# EasyEDA Pro project Servo module.epro

# Schematic Schematic1
Board Name: Board1; Create Date: 2026-03-25; Page Name: P1; Project Name: servo board rs485; Schematic Name: Schematic1; Update Date: 2026-04-03; Company: EasyEDA.com; Page Size: A4; Version: V1.0
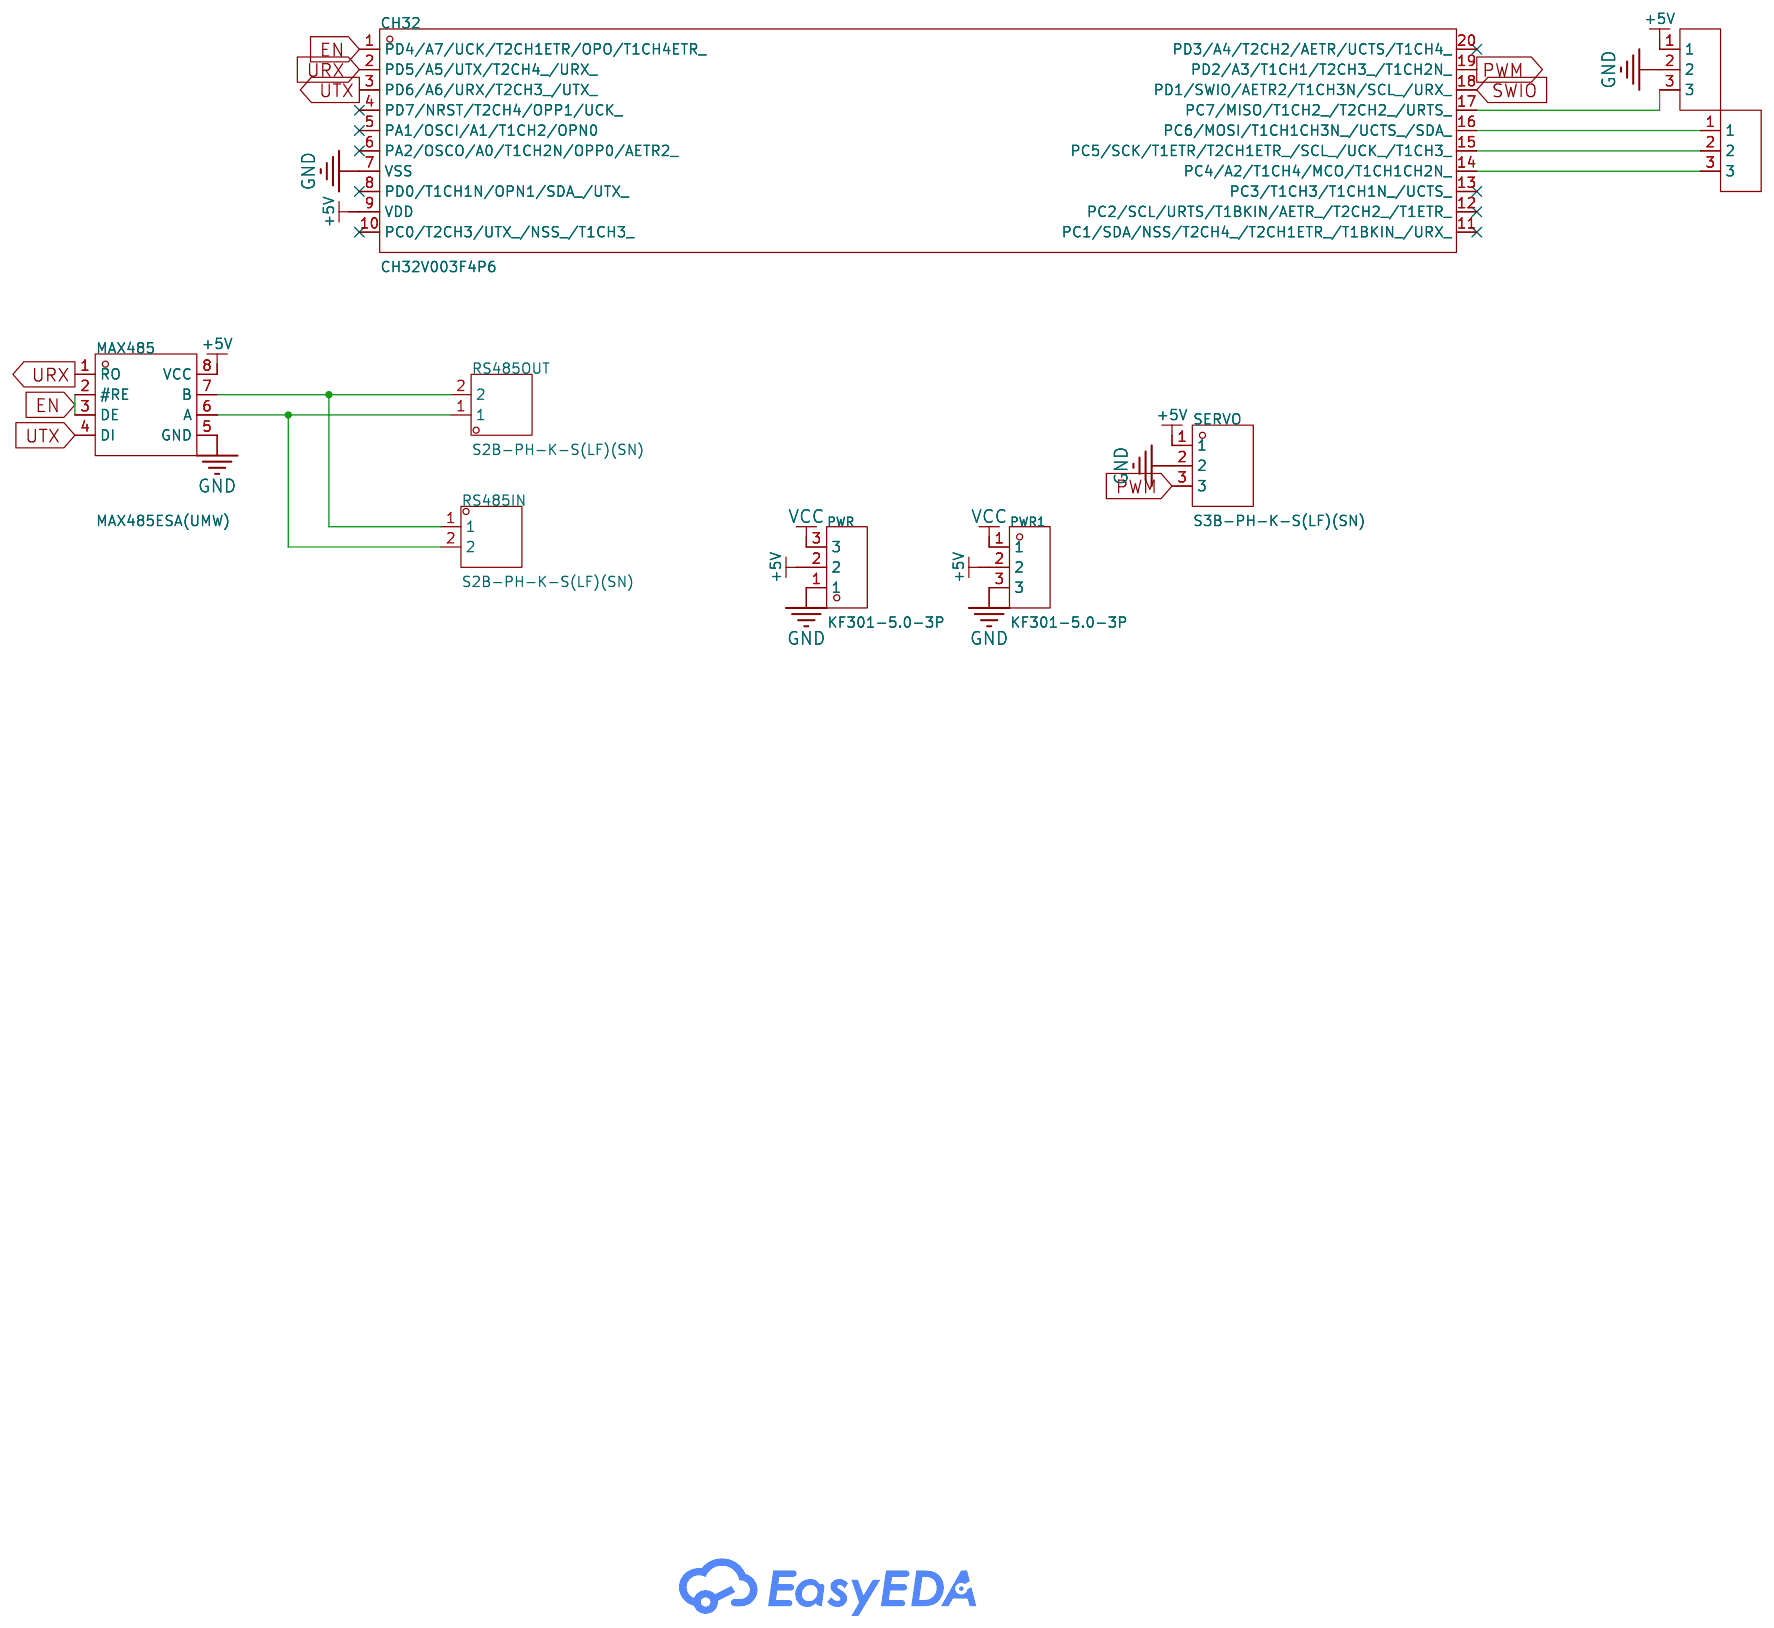
[diagram p0: schematic sheet]

## Parts
CH32  CH32V003F4P6  [TSSOP-20_L6.5-W4.4-P0.65-LS6.4-BL]
H5  -  [HDR-TH_3P-P2.54-V-M]
H6  -  [HDR-TH_3P-P2.54-V-M]
MAX485  MAX485ESA(UMW)  [SOP-8_L5.0-W4.0-P1.27-LS6.0-BL]
PWR  KF301-5.0-3P  [CONN-TH_3P-P5.00_KF301-5.0-3P]
PWR1  KF301-5.0-3P  [CONN-TH_3P-P5.00_KF301-5.0-3P]
RS485IN  S2B-PH-K-S(LF)(SN)  [CONN-TH_S2B-PH-K-S-LF-SN]
RS485OUT  S2B-PH-K-S(LF)(SN)  [CONN-TH_S2B-PH-K-S-LF-SN]
SERVO  S3B-PH-K-S(LF)(SN)  [CONN-TH_3P-P2.00_S3B-PH-K-S-LF-SN]

## Library data of the parts
CH32 = CH32V003F4P6: LCSC Part Name: QingKe V2微处理器; Supplier Part: C5187096; Manufacturer: WCH(南京沁恒); Supplier Footprint: TSSOP-20-175mil; JLCPCB Part Class: Extended Part; Datasheet: https://item.szlcsc.com/datasheet/CH32V003F4P6/5858783.html; Supplier: LCSC
H5 H6 = HDR-M_2.54_1x3P: Supplier Footprint: Through
MAX485 = MAX485ESA(UMW): Type:Transceiver Number of Drivers:1 Number of Receivers:1 Voltage - Supply:5V Voltage - Supply:5V Data Rate:2.5Mbps Data Rate:2.5Mbps Number of Nodes:32 Supply Current (Iq):300uA Communication Mode:Half-Duplex; LCSC Part Name: 低功耗、压摆率受限的RS-485/RS-422收发器; Supplier Part: C668206; Manufacturer: UMW(友台半导体); Supplier Footprint: SOP-8; JLCPCB Part Class: Extended Part; Datasheet: https://item.szlcsc.com/datasheet/MAX485ESA(UMW)/698054.html; Supplier: LCSC; Type: Transceiver; Number of Drivers: 1; Number of Receivers: 1; Voltage - Supply: 5V; Data Rate: 2.5Mbps; Number of Nodes: 32; Supply Current (Iq): 300uA; Communication Mode: Half-Duplex
PWR PWR1 = KF301-5.0-3P: Number of Positions or Pins:1x3P Pitch:5mm Color:Blue Mounting Type:Through Hole Number of Pins:3P Number of Rows:1 Number of PINs Per Row:3 Current Rating:17A Voltage Rating (Max):250V Wire Gauge - AWG:14~22 Wire Gauge - mm2:1.5 Wire Gauge - mm2:1.5 Oper; LCSC Part Name: 1x3P 5mm 直插 排数:1 每排P数:3; Supplier Part: C474882; Manufacturer: KEFA(科发); Supplier Footprint: 插件,P=5mm; JLCPCB Part Class: Extended Part; Datasheet: https://item.szlcsc.com/datasheet/KF301-5.0-3P/481500.html; Supplier: LCSC; Number of Positions or Pins: 1x3P; Pitch: 5mm; Color: Blue; Mounting Type: Through Hole; Number of Pins: 3P; Number of Rows: 1; Number of PINs Per Row: 3; Current Rating: 17A; Voltage Rating (Max): 250V; Wire Gauge - AWG: 14~22; Wire Gauge - mm2: 1.5; Operating Temperature: -30℃~+120℃
RS485IN RS485OUT = S2B-PH-K-S(LF)(SN): Pins Structure:1x2P Pitch:2mm Mounting Type:Right Angle Reference Series:PH Number of Pins:2P Number of Rows:1 Number of PINs Per Row:2 Row Spacing:- Current Rating:2A Contact Material:Brass Contact Plating:Tin Operating Temperature:-25℃~+85℃ Operating Te; LCSC Part Name: 1x2P 间距:2mm 弯插 系列:PH; Supplier Part: C173752; Manufacturer: JST; Supplier Footprint: 弯插,P=2mm; JLCPCB Part Class: Extended Part; Datasheet: https://item.szlcsc.com/datasheet/S2B-PH-K-S(LF)(SN)/185142.html; Supplier: LCSC; Pins Structure: 1x2P; Pitch: 2mm; Mounting Type: Right Angle; Reference Series: PH; Number of Pins: 2P; Number of Rows: 1; Number of PINs Per Row: 2; Current Rating: 2A; Contact Material: Brass; Contact Plating: Tin; Operating Temperature: -25℃~+85℃; Voltage Rating: 100V; Plastic Material: PA66; Flame Retardant Rating: UL94V-0; Supplementary Features: K Pin; Color: White; Z-Height of the Board: 4.8mm; X-Length of Bottom Edge on Board (Spacing Line): 5.9mm; Y-Width of Bottom Edge on Board: 7.6mm
SERVO = S3B-PH-K-S(LF)(SN): Pins Structure:1x3P Pitch:2mm Mounting Type:Right Angle Reference Series:PH Number of Pins:3P Number of Rows:1 Number of PINs Per Row:3 Row Spacing:- Current Rating:2A Contact Material:Brass Contact Plating:Tin Operating Temperature:-25℃~+85℃ Operating Te; LCSC Part Name: 1x3P 间距:2mm 弯插 系列:PH; Supplier Part: C157929; Manufacturer: JST; Supplier Footprint: 弯插,P=2mm; JLCPCB Part Class: Extended Part; Datasheet: https://item.szlcsc.com/datasheet/S3B-PH-K-S(LF)(SN)/169277.html; Supplier: LCSC; Pins Structure: 1x3P; Pitch: 2mm; Mounting Type: Right Angle; Reference Series: PH; Number of Pins: 3P; Number of Rows: 1; Number of PINs Per Row: 3; Current Rating: 2A; Contact Material: Brass; Contact Plating: Tin; Operating Temperature: -25℃~+85℃; Voltage Rating: 100V; Plastic Material: PA66; Flame Retardant Rating: UL94V-0; Supplementary Features: K Pin; Color: White; Z-Height of the Board: 4.8mm; X-Length of Bottom Edge on Board (Spacing Line): 7.9mm; Y-Width of Bottom Edge on Board: 7.6mm

## Nets
+5V: CH32.9(VDD) H5.1 MAX485.8(VCC) PWR.2 PWR1.2 SERVO.1
GND: CH32.7(VSS) H5.2 MAX485.5(GND) PWR.1 PWR1.3 SERVO.2
VCC: PWR.3 PWR1.1
EN: CH32.1(PD4/A7/UCK/T2CH1ETR/OPO/T1CH4ETR_) MAX485.2(#RE) MAX485.3(DE)
PWM: CH32.19(PD2/A3/T1CH1/T2CH3_/T1CH2N_) SERVO.3
SWIO: CH32.18(PD1/SWIO/AETR2/T1CH3N/SCL_/URX_)
URX: CH32.2(PD5/A5/UTX/T2CH4_/URX_) MAX485.1(RO)
UTX: CH32.3(PD6/A6/URX/T2CH3_/UTX_) MAX485.4(DI)
$1N504: MAX485.6(A) RS485IN.2 RS485OUT.1
$1N506: MAX485.7(B) RS485IN.1 RS485OUT.2
$1N1347: CH32.15(PC5/SCK/T1ETR/T2CH1ETR_/SCL_/UCK_/T1CH3_) H6.2
$1N1353: CH32.16(PC6/MOSI/T1CH1CH3N_/UCTS_/SDA_) H6.1
$1N1530: CH32.17(PC7/MISO/T1CH2_/T2CH2_/URTS_) H5.3
$1N2389: CH32.14(PC4/A2/T1CH4/MCO/T1CH1CH2N_) H6.3

Not connected (* = marked no-connect by the designer): CH32 4(PD7/NRST/T2CH4/OPP1/UCK_)* 5(PA1/OSCI/A1/T1CH2/OPN0)* 6(PA2/OSCO/A0/T1CH2N/OPP0/AETR2_)* 8(PD0/T1CH1N/OPN1/SDA_/UTX_)* 10(PC0/T2CH3/UTX_/NSS_/T1CH3_)* 11(PC1/SDA/NSS/T2CH4_/T2CH1ETR_/T1BKIN_/URX_)* 12(PC2/SCL/URTS/T1BKIN/AETR_/T2CH2_/T1ETR_)* 13(PC3/T1CH3/T1CH1N_/UCTS_)* 20(PD3/A4/T2CH2/AETR/UCTS/T1CH4_)*

# Board PCB1
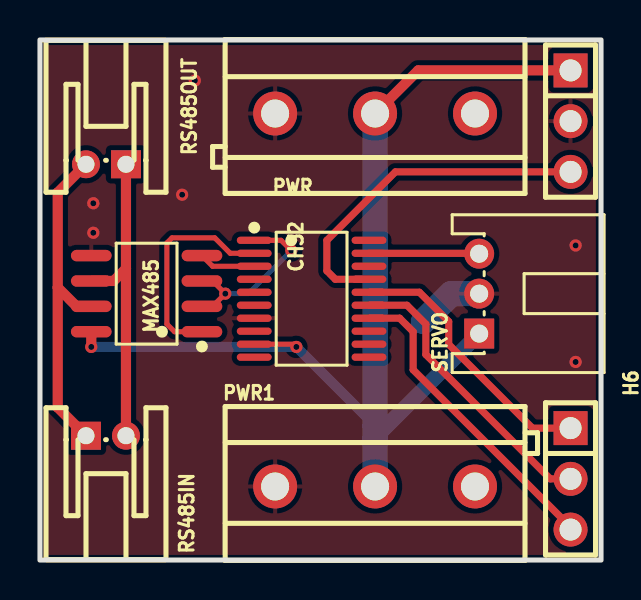
[diagram p1: board, top side]
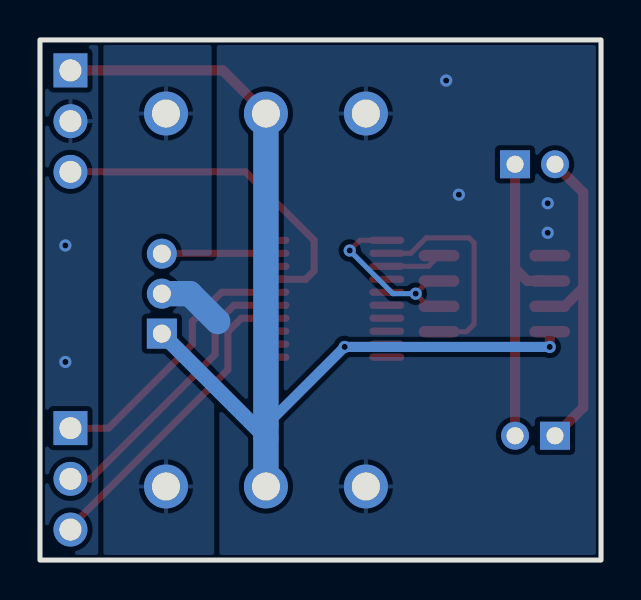
[diagram p2: board, bottom side, seen from below]

Outline 28.07 x 26.04 mm; copper layers: Top Layer, Bottom Layer. Coordinates in mm from the lower left corner of the outline.
Outline path: rectangle 0,26.04 28.07,0
Stack: Top Layer 0.035mm / Dielectric1 1.51mm FR4 er 4.5 / Bottom Layer 0.035mm

## Design rules (mm)
template: Custom Config
spacing copperThickness1oz (default): track to track 0.102, other pairs 0.152 to 0.3
spacing copperThickness2oz: track to track 0.203, other pairs 0.152 to 0.3
track width copperThickness1oz (default): min 0.127, default 0.254, max 2.54
track width copperThickness2oz: min 0.203, default 0.254, max 2.54
differential pair differentialPair (default): width min 0.127, default 0.254, max 2.54; gap min 0.152, default 0.152
via viaSize (default): diameter min 0.5, default 0.61, max 10; hole min 0.3, default 0.305, max 6.3

## Placement (name value [footprint] x y rotation side)
CH32  CH32V003F4P6  [TSSOP-20_L6.5-W4.4-P0.65-LS6.4-BL]  13.59 13.08 270 top
H5  -  [HDR-TH_3P-P2.54-V-M]  26.54 21.97 270 top
H6  -  [HDR-TH_3P-P2.54-V-M]  26.54 4.06 270 top
MAX485  MAX485ESA(UMW)  [SOP-8_L5.0-W4.0-P1.27-LS6.0-BL]  5.33 13.34 90 top
PWR  KF301-5.0-3P  [CONN-TH_3P-P5.00_KF301-5.0-3P]  16.76 22.35 180 top
PWR1  KF301-5.0-3P  [CONN-TH_3P-P5.00_KF301-5.0-3P]  16.76 3.68 0 top
RS485IN  S2B-PH-K-S(LF)(SN)  [CONN-TH_S2B-PH-K-S-LF-SN]  3.3 6.22 180 top
RS485OUT  S2B-PH-K-S(LF)(SN)  [CONN-TH_S2B-PH-K-S-LF-SN]  3.3 19.81 0 top
SERVO  S3B-PH-K-S(LF)(SN)  [CONN-TH_3P-P2.00_S3B-PH-K-S-LF-SN]  21.97 13.34 90 top

## Footprints (pads in the part's own frame, mm; a bottom-side part is the same pattern mirrored in y, then rotated)
CONN-TH_3P-P2.00_S3B-PH-K-S-LF-SN
  rect 1.5x1.5 hole 0.9: 1(-2,0)
  round 1.5 hole 0.9: 2(0,0) 3(2,0)
CONN-TH_3P-P5.00_KF301-5.0-3P
  round 2.2 hole 1.4: 1(-5,0) 2(0,0) 3(5,0)
CONN-TH_S2B-PH-K-S-LF-SN
  rect 1.5x1.4 hole 0.85: 1(1,0)
  round 1.4 hole 0.85: 2(-1,0)
HDR-TH_3P-P2.54-V-M
  rect 1.7x1.7 hole 1.1: 1(-2.54,0)
  round 1.7 hole 1.1: 2(0,0) 3(2.54,0)
SOP-8_L5.0-W4.0-P1.27-LS6.0-BL
  oval 0.574x2.035 smd: 1(-1.905,-2.768) 2(-0.635,-2.768) 3(0.635,-2.768) 4(1.905,-2.768) 5(1.905,2.768) 6(0.635,2.768) 7(-0.635,2.768) 8(-1.905,2.768)
TSSOP-20_L6.5-W4.4-P0.65-LS6.4-BL
  oval 0.364x1.742 smd: 1(-2.925,-2.871) 2(-2.275,-2.871) 3(-1.625,-2.871) 4(-0.975,-2.871) 5(-0.325,-2.871) 6(0.325,-2.871) 7(0.975,-2.871) 8(1.625,-2.871) 9(2.275,-2.871) 10(2.925,-2.871) 11(2.925,2.871) 12(2.275,2.871) 13(1.625,2.871) 14(0.975,2.871) 15(0.325,2.871) 16(-0.325,2.871) 17(-0.975,2.871) 18(-1.625,2.871) 19(-2.275,2.871) 20(-2.925,2.871)

## Nets
As in the schematic, except:
GND: CH32.7 H5.2 MAX485.5 PWR.3 PWR1.1 SERVO.2
VCC: PWR.1 PWR1.3

Pads without a net: CH32 4 5 6 8 11 12 13 20

## Via types
v1: diameter 0.61, hole 0.305, Top Layer to Bottom Layer, 10 vias

## Routing (per net, layer and track width the routed paths; a pad name or vN(x,y) marks a point on that pad's centre or on a via; arc(x,y) is an arc through that point)
+5V: length 55.5
  Top Layer w0.254: 10.72,10.81 12.69,10.81 v1(12.83,10.67)
  Top Layer w0.508: PWR.2 18.92,24.51 H5.1 ; MAX485.8 v1(2.57,10.67)
  Bottom Layer w0.508: v1(2.57,10.67) v1(12.83,10.67) 16.76,6.73
  Bottom Layer w0.762: SERVO.1 16.76,6.13
  Bottom Layer w1.27: PWR.2 PWR1.2
GND: length 3.4
  Bottom Layer w1.27: 19.18,11.94 20.57,13.34 SERVO.2
  vias: v1(2.67,17.86) v1(2.67,16.38) v1(7.11,18.29) v1(7.75,24) v1(26.8,15.75) v1(26.8,9.92)
EN: length 9.1
  Top Layer w0.254: 10.72,16.01 12.06,16.01 v1(12.57,15.49) ; MAX485.2 8.64,12.7 v1(9.27,13.34) 8.64,13.97 8.1,13.97
  Bottom Layer w0.254: v1(12.57,15.49) 10.41,13.34 v1(9.27,13.34)
PWM: length 5.5
  Top Layer w0.355: CH32.19 21.95,15.36 SERVO.3
URX: length 10.8
  Top Layer w0.254: MAX485.1 6.73,11.43 6.35,11.81 6.35,15.88 6.6,16.13 8.74,16.13 9.52,15.36 10.72,15.36
UTX: length 2.8
  Top Layer w0.254: 10.72,14.71 8.64,14.71 MAX485.4
$1N504: length 15.6
  Top Layer w0.508: 2.57,13.97 3.68,13.97 4.3,14.59 ; 4.3,14.59 RS485IN.2 ; 4.3,14.59 RS485OUT.1
$1N506: length 16.8
  Top Layer w0.508: RS485IN.1 0.89,7.64 0.89,13.64 ; 0.89,13.64 0.89,18.4 RS485OUT.2 ; 0.89,13.64 1.83,12.7 MAX485.7
$1N1347: length 14.6
  Top Layer w0.355: H6.2 25.53,4.06 19.3,10.29 19.3,11.81 18.36,12.76 CH32.15
$1N1353: length 13.6
  Top Layer w0.355: H6.1 24.64,6.6 20.45,10.8 20.45,11.94 18.98,13.41 CH32.16
$1N1530: length 17.4
  Top Layer w0.355: CH32.17 14.77,14.06 14.35,14.48 14.35,16 17.78,19.43 H5.3
$1N2389: length 15.7
  Top Layer w0.355: CH32.14 17.99,12.11 18.67,11.43 18.67,9.53 26.54,1.65 H6.3

## Copper pours and planes (outline as drawn; the poured copper is in the pictures)
GND on Top Layer: -2.54,31.12 32.89,31.12 32.89,-4.57 -2.54,-4.57
GND on Bottom Layer: -1.65,28.19 29.34,28.19 29.34,-1.91 -1.65,-1.91
VCC on Bottom Layer: 21.97,11.34 19.35,8.75 19.35,-0.76 24.89,-0.76 24.89,26.54 19.48,26.54 19.48,15.24 21.97,15.24
